# EAGLE design Serial Port (EAGLE 9.6.0)
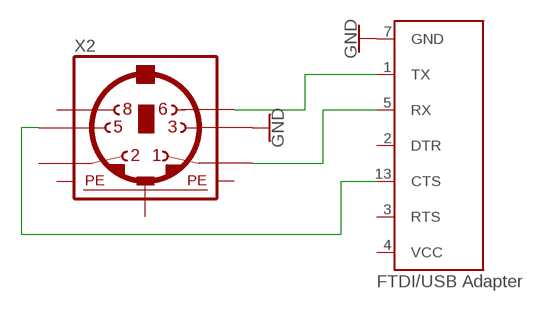
[diagram p0: schematic, sheet 1]

## Parts
U6  FTDI  [FTDI]
X2  MINI_DIN_6  [M_DIN6]

## Nets
GND: U6.7(GND) X2.3
N$1: U6.1(TX) X2.6
N$2: U6.5(RX) X2.1
N$3: U6.13(CTS) X2.5
Unconnected: U6.2(DTR) U6.3(RTS) U6.4(VCC) X2.2 X2.8

## Notes on the sheet
- FTDI/USB Adapter

## Power pins joined to a net without a drawn wire
PE1: X2.SH1(PE1)
PE2: X2.SH2(PE2)
PE3: X2.SH3(PE3)

## Library data of the parts
U6 = Liam's Inventions:FTDI
X2 = mini_din:MINI_DIN_6

## Board
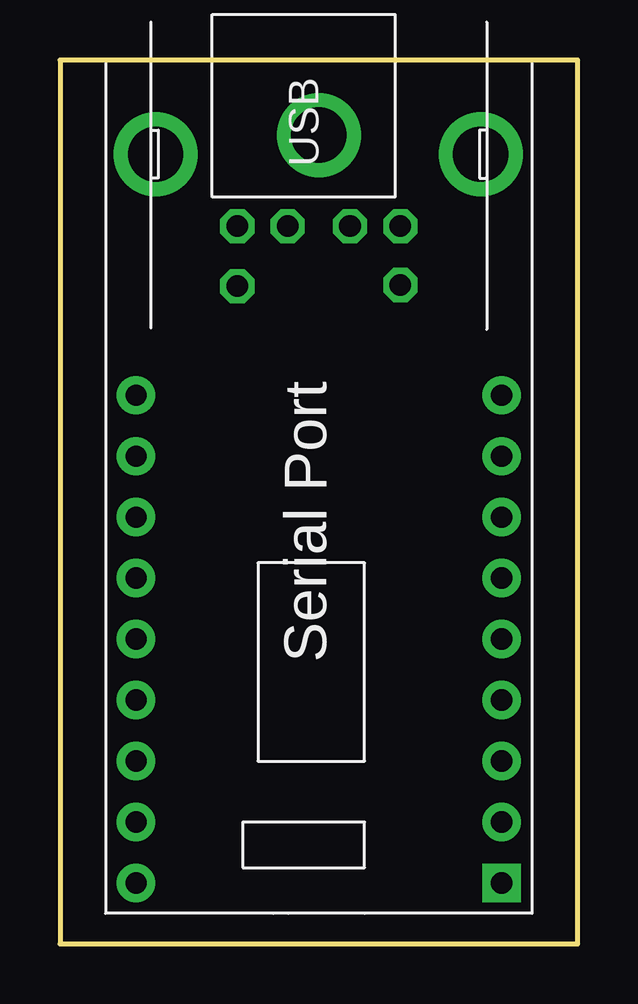
[diagram p1: board, top side]
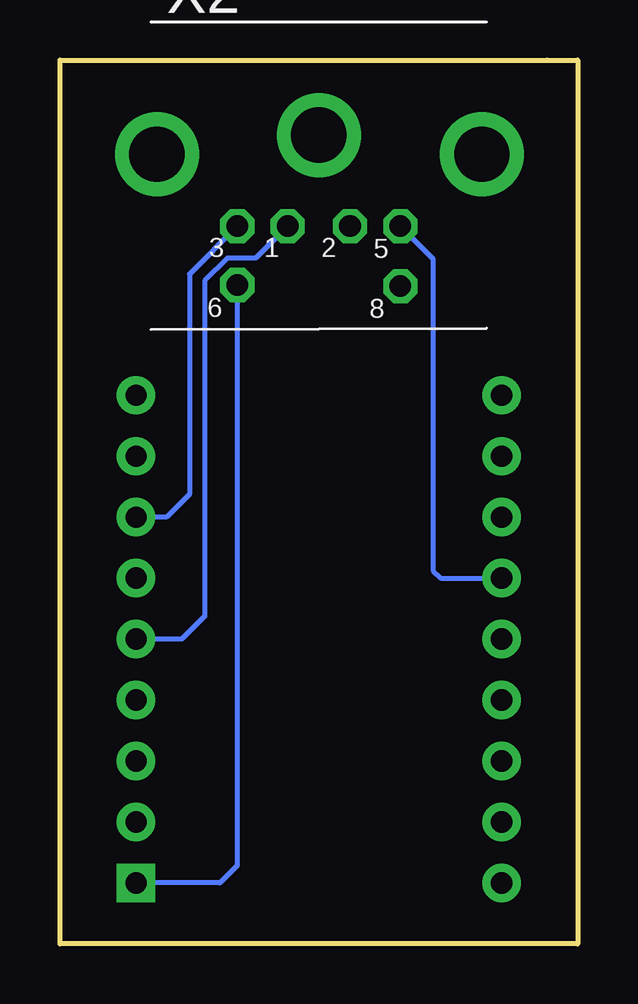
[diagram p2: board, bottom side, seen from below]

Size 21.59 x 36.83 mm. Coordinates in mm from the lower left corner, seen from the top.
Outline: 1.27,36.83 0,36.83 0,0 21.59,0 21.59,36.83 1.27,36.83
Copper layers (1*16): Top 0.035mm / dielectric 1.5mm / Bottom 0.035mm
Design rules "default *": minimum track width 8mil, minimum drill 0.35mm, track to track 6mil, track to pad 6mil, pad to pad 6mil, via to via 6mil, smd to smd 6mil, copper to edge 6mil, drill to drill 6mil, minimum pad ring 10mil, minimum via ring 8mil, stop-mask expansion 4mil, vias tented up to drill 0mil, thermal gap 10mil

### Footprints (pad centres in the part's own frame; a part is rotated, then mirrored left to right if it is on the bottom)
FTDI = drill 0.889 pad 1.6 square: 1 -22.86,-7.62 | drill 0.889 pad 1.6: 2 -20.32,-7.62; 3 -17.78,-7.62; 4 -15.24,-7.62; 5 -12.7,-7.62; 6 -10.16,-7.62; 7 -7.62,-7.62; 8 -5.08,-7.62; 9 -2.54,-7.62; 10 -2.54,7.62; 11 -5.08,7.62; 12 -7.62,7.62; 13 -10.16,7.62; 14 -12.7,7.62; 15 -15.24,7.62; 16 -17.78,7.62; 17 -20.32,7.62; 18 -22.86,7.62
M_DIN6 = drill 0.9 pad 1.422 octagon: 1 -1.3,-3.75; 2 1.3,-3.75; 3 -3.4,-3.75; 5 3.4,-3.75; 6 -3.4,-6.2; 8 3.4,-6.25 | drill 2.3 pad 3.5: SH1 6.8,-0.75; SH2 0,0.05; SH3 -6.75,-0.75

### Placement (x,y rotation side)
U6  10.8,25.4 90 top
X2  10.8,33.66 0 bottom

### Tracks (layer width: path | path; a pad name or v marks a point on that pad's centre or on a via)
GND
  Bottom 0.203: X2.3 16.19,27.91 16.19,18.73 17.15,17.78 U6.7
N$1
  Bottom 0.203: X2.6 14.19,3.27 14.92,2.54 U6.1
N$2
  Bottom 0.203: X2.1 13.42,28.58 14.61,28.58 15.56,27.62 15.56,13.65 16.51,12.7 U6.5
N$3
  Bottom 0.203: X2.5 6.03,28.54 6.03,15.56 5.72,15.24 U6.13

### Text on the board
tPlace: Serial Port